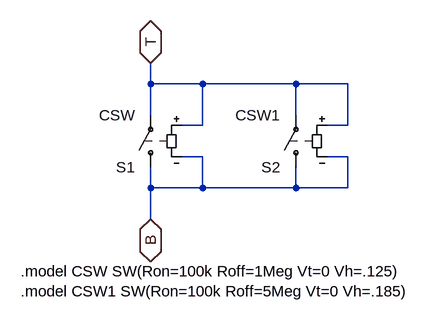
[diagram p0: schematic mbit1.asc]
mbit1.asc, the LTspice schematic file:
Version 4
SHEET 1 984 680
WIRE -288 -128 -288 -160
WIRE -208 -128 -288 -128
WIRE -64 -128 -208 -128
WIRE 16 -128 -64 -128
WIRE -288 -80 -288 -128
WIRE -64 -80 -64 -128
WIRE -208 -64 -208 -128
WIRE -208 -64 -240 -64
WIRE 16 -64 16 -128
WIRE 16 -64 -16 -64
WIRE -208 -16 -240 -16
WIRE 16 -16 -16 -16
WIRE -288 32 -288 0
WIRE -208 32 -208 -16
WIRE -208 32 -288 32
WIRE -64 32 -64 0
WIRE -64 32 -208 32
WIRE 16 32 16 -16
WIRE 16 32 -64 32
WIRE -288 80 -288 32
FLAG -288 -160 T
IOPIN -288 -160 BiDir
FLAG -288 80 B
IOPIN -288 80 BiDir
SYMBOL sw -288 16 R180
SYMATTR InstName S1
SYMATTR Value CSW
SYMBOL sw -64 16 R180
SYMATTR InstName S2
SYMATTR Value CSW1
TEXT -488 160 Left 0 !.model CSW SW(Ron=100k Roff=1Meg Vt=0 Vh=.125)\n.model CSW1 SW(Ron=100k Roff=5Meg Vt=0 Vh=.185)

The netlist it stands for:
* mbit1.asc
S1 B T T B CSW
S2 B T T B CSW1
.model CSW SW(Ron=100k Roff=1Meg Vt=0 Vh=.125)
.model CSW1 SW(Ron=100k Roff=5Meg Vt=0 Vh=.185)
.backanno
.end